# EAGLE design LB_BIT_o15_UV_LED-v02(rev1) (EAGLE 6.6.0)
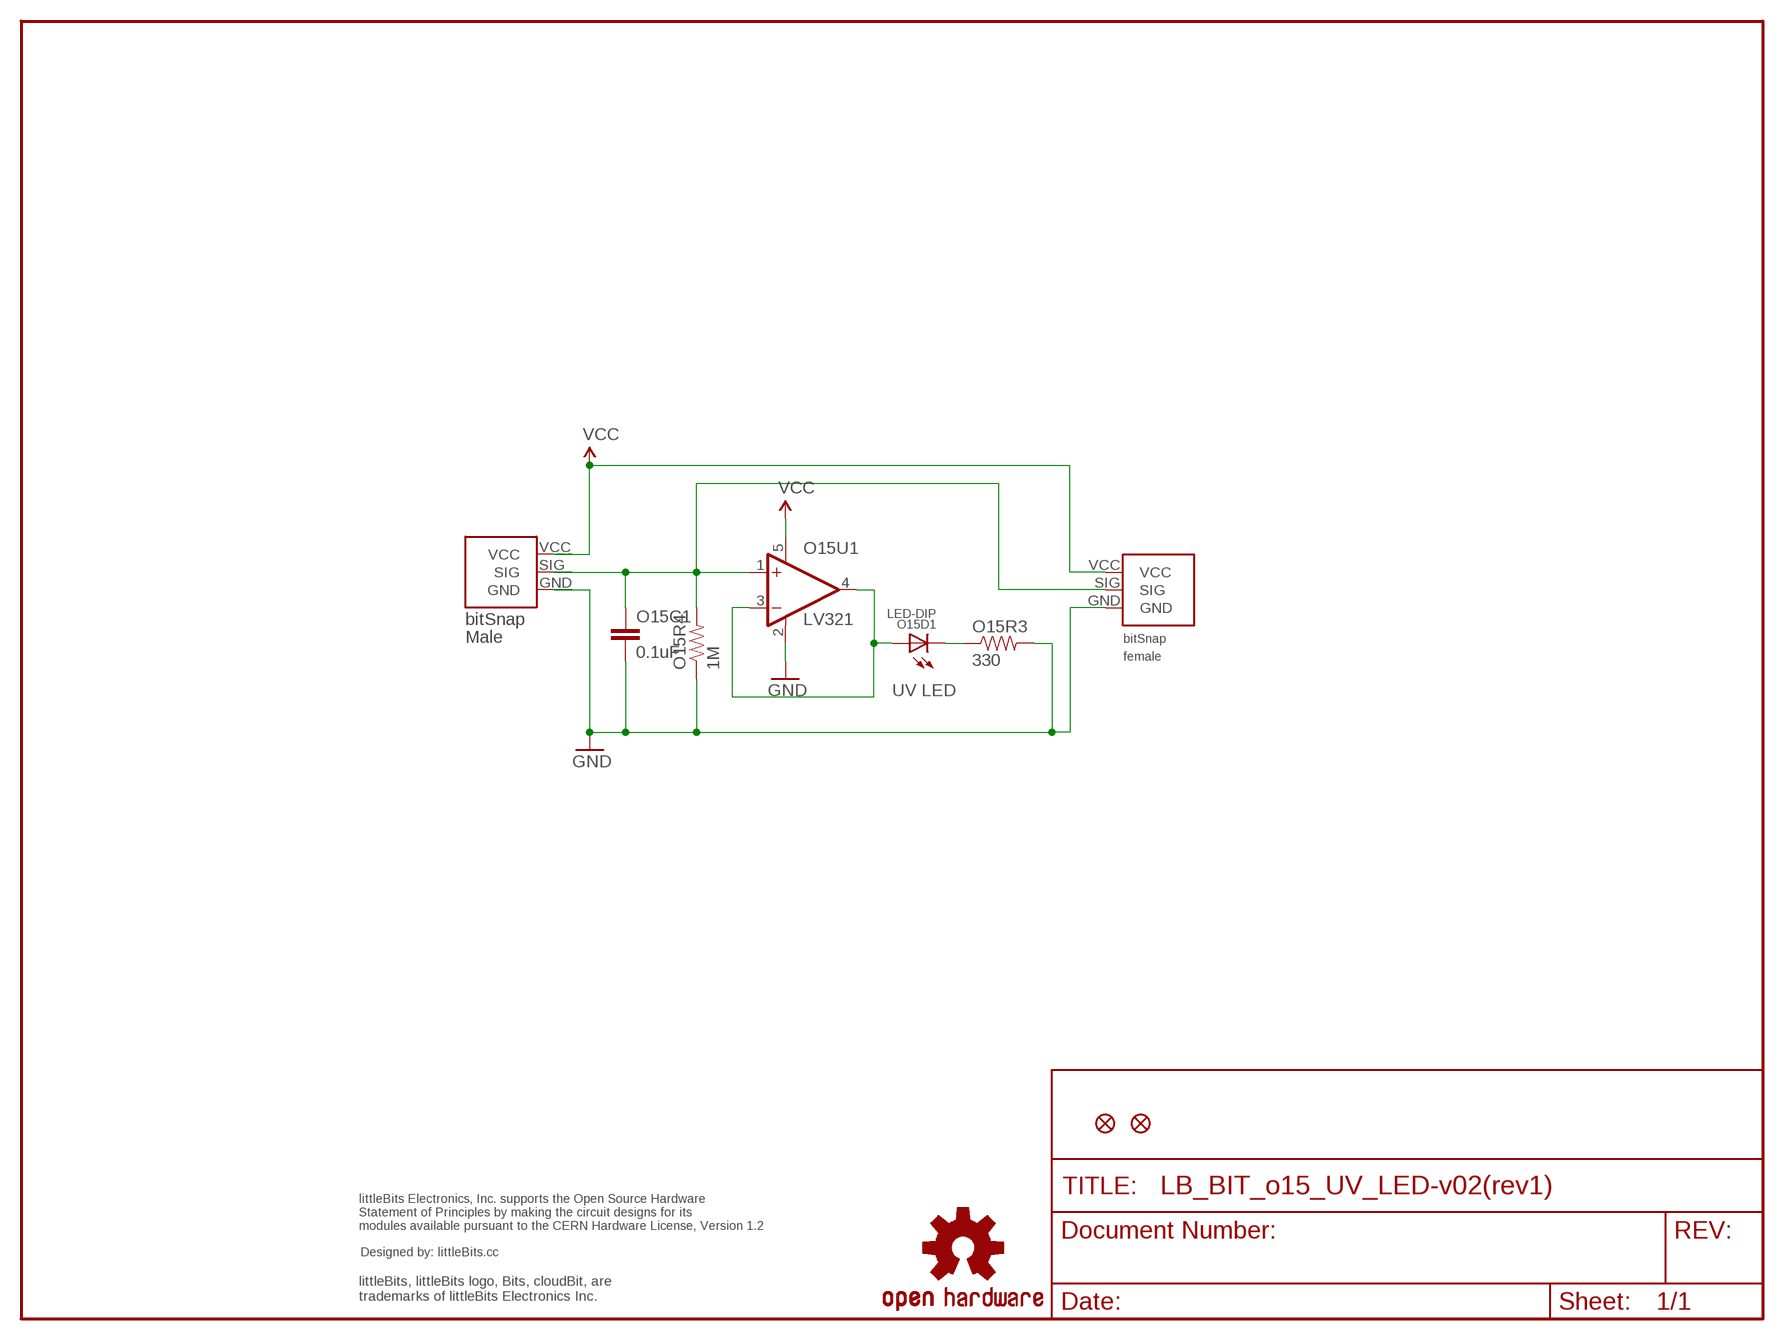
[diagram p0: schematic, sheet 1]

## Parts
O15BSF  BITSNAP_FEMALE  [BITSNAP_FEMALE]
O15BSM  BITSNAP_MALE  [BITSNAP_MALE]
O15C1  0.1uF  CAP0603-CAP  [0603-CAP]
O15D1  LED-DIP  [LED-DIP]
O15FD1  FIDUCIAL1X2.5  [FIDUCIAL-1X2.5]
O15FD2  FIDUCIAL1X2.5  [FIDUCIAL-1X2.5]
O15R3  330  RESISTOR0603-RES  [0603-RES]
O15R4  1M  RESISTOR0603-RES  [0603-RES]
O15U1  LV321  [SC70-5]
U$1  OSHWCREDIT  [OSHWCREDIT]
U$3  OSHW-LOGOL  [OSHW-LOGO-L]

## Nets
GND: O15BSF.GND O15BSM.GND O15C1.2 O15R3.2 O15R4.1 O15U1.2(V-)
LEDGND: O15D1.C O15R3.1
N$1: O15D1.A O15U1.3(-IN) O15U1.4(OUT)
SIG: O15BSF.SIG O15BSM.SIG O15C1.1 O15R4.2 O15U1.1(+IN)
VCC: O15BSF.VCC O15BSM.VCC O15U1.5(V+)

## Notes on the sheet
- UV LED

## Library data of the parts
O15BSF = bitSnap:BITSNAP_FEMALE
O15BSM = bitSnap:BITSNAP_MALE
O15C1 = SparkFun:CAP: Capacitor Standard 0603 ceramic capacitor, and 0.1" leaded capacitor.
O15D1 = LITTLEBITS:LED-DIP
O15FD1 O15FD2 = abes:FIDUCIAL: Fiducial Alignment Points Various fiducial points for machine vision alignment.
O15R3 O15R4 = SparkFun:RESISTOR: Resistor Basic schematic elements and footprints for 0603, 1206, and PTH 1/10th watt (small) resistors.
O15U1 = LITTLEBITS:LV321
U$1 = LITTLEBITS:OSHWCREDIT
U$3 = SparkFun:OSHW-LOGO: Open Source Hardware Logo This logo indicates the piece of hardware it is found on incorporates a OSHW license and/or adheres to the definition of open source hardware found here: http://freedomdefined.org/OSHW

## Board
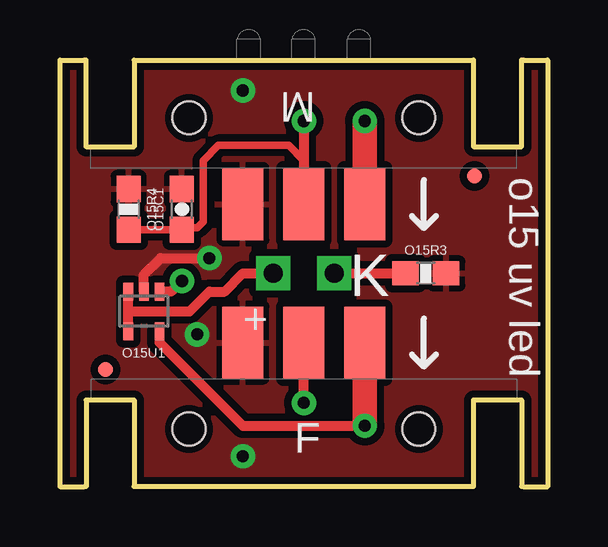
[diagram p1: board, top side]
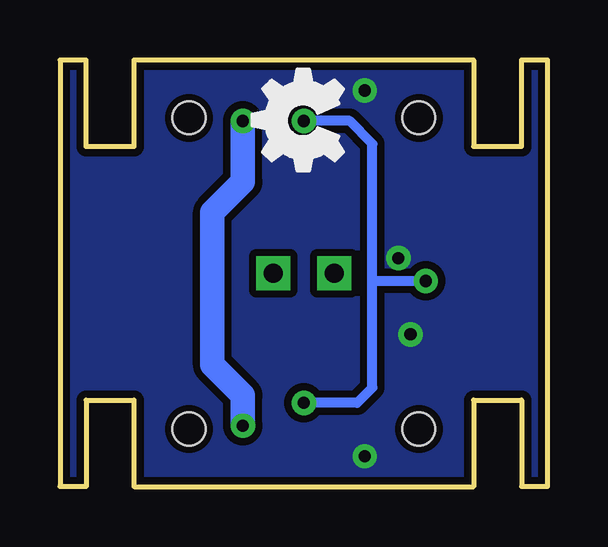
[diagram p2: board, bottom side, seen from below]

Size 20.32 x 17.78 mm. Coordinates in mm from the lower left corner, seen from the top.
Outline: 1.02,17.78 0,17.78 0,0 1.02,0
Outline: 19.3,17.78 20.32,17.78 20.32,0 19.3,0
Copper layers (1*16): Top 0.035mm / dielectric 1.5mm / Bottom 0.035mm
Design rules "default": minimum track width 8mil, minimum drill 20mil, track to track 8mil, track to pad 8mil, pad to pad 8mil, via to via 8mil, smd to smd 8mil, copper to edge 8mil, drill to drill 8mil, minimum pad ring 12mil, minimum via ring 10mil, stop-mask expansion 4mil, vias tented up to drill 20mil, thermal gap 10mil

### Footprints (pad centres in the part's own frame; a part is rotated, then mirrored left to right if it is on the bottom)
BITSNAP_FEMALE = smd 1.7 x 3: GND 6.35,6; SIG 8.89,6; VCC 11.43,6 | hole 1.37: 13.68,2.41; 4.1,2.41
BITSNAP_MALE = smd 1.7 x 3: GND 11.43,6; SIG 8.89,6; VCC 6.35,6 | hole 1.37: 13.68,2.41; 4.1,2.41
0603-CAP = smd 1.1 x 1: 1 -0.85,0; 2 0.85,0
LED-DIP = drill 0.8 square: A -1.27,0; C 1.27,0
FIDUCIAL-1X2.5 = smd 0.635 x 0.635: 1 0,0
0603-RES = smd 1.1 x 1: 1 -0.85,0; 2 0.85,0
SC70-5 = smd 0.4 x 0.75: 1 -0.65,-0.825; 2 0,-0.825; 3 0.65,-0.825; 4 0.65,0.825; 5 -0.65,0.825

### Placement (x,y rotation side)
O15BSF  1.27,0 0 top
O15BSM  19.05,17.78 180 top
O15C1  5.08,11.56 90 top
O15D1  10.16,8.89 0 top
O15FD1  17.27,12.95 0 top
O15FD2  1.91,4.89 0 top
O15R3  15.24,8.89 0 top
O15R4  2.86,11.56 270 top
O15U1  3.49,7.3 180 top
U$1  -34,-26.9 0 top  (outside the outline)
U$3  -24.13,-15.24 0 top  (outside the outline)
U$6  [OSHW_FILLX150_NOTEXT]  8.51,12.32 0 top

### Tracks (layer width: path | path; a pad name or v marks a point on that pad's centre or on a via)
GND  (via drill 0.51)
  Top 0.406: v6.22,9.53 4.19,9.53 3.49,8.83 O15U1.2
  other vias: 7.62,16.51 5.71,6.35 7.62,1.27
  pour Top (isolate 0.305): 0,17.78 20.32,17.78 20.32,0 0,0
  pour Bottom (isolate 0.305): 0,17.78 0,0 20.32,0 20.32,17.78
LEDGND
  Top 0.406: O15D1.C O15R3.1
N$1
  Top 0.406: O15D1.A 7.62,8.89 6.86,8.13 6.22,8.13 5.4,7.3 2.84,7.3 | O15U1.4 2.84,7.3 | 2.84,7.3 O15U1.3
SIG  (via drill 0.51, 0.51 pad 1.02)
  Top 0.305: 2.91,10.77 O15R4.2 O15C1.1 5.09,10.79 5.71,10.79 5.97,11.05 5.97,13.59 6.6,14.22 9.53,14.22 10.16,13.59 O15BSM.SIG
  Top 0.406: v10.16,15.24 O15BSM.SIG | v10.16,3.49 O15BSF.SIG | O15U1.1 4.63,8.13 v5.08,8.57
  Bottom 0.406: v10.16,15.24 8.26,15.24 7.3,14.29 7.3,8.57 | 7.3,8.57 7.3,4.13 7.94,3.49 v10.16,3.49 | 7.3,8.57 v5.08,8.57
VCC  (via drill 0.51)
  Top 0.305: 12.7,5.08 O15BSF.VCC
  Top 0.406: v12.7,2.54 7.62,2.54 4.14,6.02 O15U1.5
  Top 1.016: v12.7,15.24 O15BSM.VCC | v12.7,2.54 12.7,5.08
  Bottom 1.016: v12.7,2.54 12.7,3.81 13.97,5.08 13.97,11.43 12.7,12.7 v12.7,15.24

### Text on the board
tPlace: o15 uv led
tNames: K
tValues: UV LED